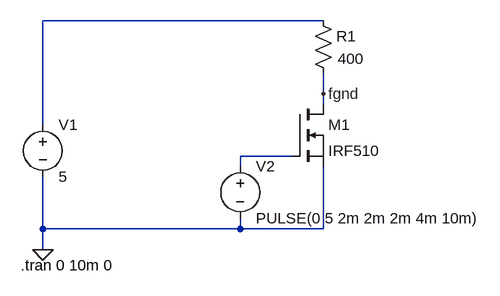
[diagram p0: schematic GND_switch2.asc]
GND_switch2.asc, the LTspice schematic file:
Version 4
SHEET 1 880 680
WIRE 224 16 -208 16
WIRE 224 128 224 96
WIRE 224 144 224 128
WIRE -208 176 -208 16
WIRE 176 224 96 224
WIRE 96 240 96 224
WIRE -208 336 -208 256
WIRE 96 336 96 320
WIRE 96 336 -208 336
WIRE 224 336 224 240
WIRE 224 336 96 336
WIRE -208 368 -208 336
FLAG -208 368 0
FLAG 224 128 fgnd
SYMBOL nmos 176 144 R0
SYMATTR InstName M1
SYMATTR Value IRF510
SYMBOL voltage -208 160 R0
SYMATTR InstName V1
SYMATTR Value 5
SYMBOL voltage 96 224 R0
WINDOW 123 0 0 Left 2
WINDOW 39 0 0 Left 2
SYMATTR InstName V2
SYMATTR Value PULSE(0 5 2m 2m 2m 4m 10m)
SYMBOL res 208 0 R0
WINDOW 3 38 74 Left 2
SYMATTR InstName R1
SYMATTR Value 400
TEXT -242 392 Left 2 !.tran 0 10m 0

The netlist it stands for:
* GND_switch2.asc
M1 fgnd N002 0 0 IRF510
V1 N001 0 5
V2 N002 0 PULSE(0 5 2m 2m 2m 4m 10m)
R1 N001 fgnd 400
.model NMOS NMOS
.model PMOS PMOS
.lib standard.mos
.tran 0 10m 0
.backanno
.end